# Altium schematic sheet ClockTamerMotherboard.SchDoc
size A4
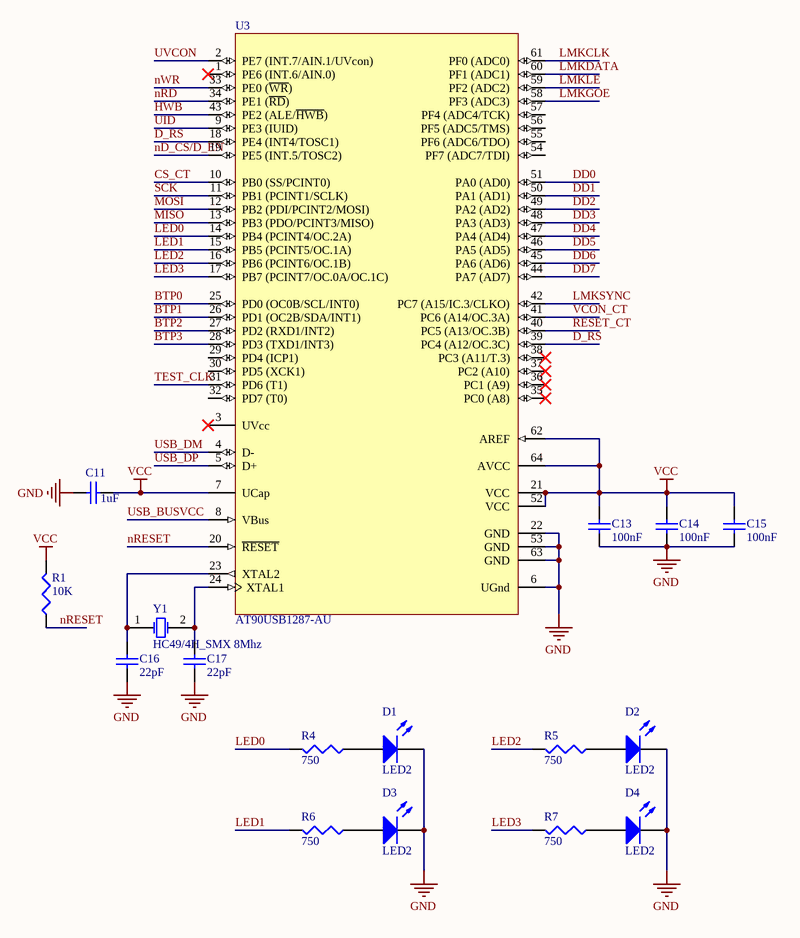
[diagram p0: ClockTamerMotherboard.SchDoc]

## Parts
C11  1uF  [1608[0603]]
C13  100nF  [1608[0603]]
C14  100nF  [1608[0603]]
C15  100nF  [1608[0603]]
C16  22pF  [1608[0603]]
C17  22pF  [1608[0603]]
D1  LED2  [3.2X1.6X1.1]
D2  LED2  [3.2X1.6X1.1]
D3  LED2  [3.2X1.6X1.1]
D4  LED2  [3.2X1.6X1.1]
R1  10K  [J1-0603]
R4  750  [J1-0603]
R5  750  [J1-0603]
R6  750  [J1-0603]
R7  750  [J1-0603]
U3  AT90USB1287-AU  [64MD_N]
Y1  HC49/4H_SMX 8Mhz  [HC49/4H_SMX]

## Nets
GND: C11.1 C13.2 C14.1 C15.1 C16.1 C17.1 D1.2(K) D2.2(K) D3.2(K) D4.2(K) U3.6(UGnd) U3.22(GND) U3.53(GND) U3.63(GND)
VCC: C11.2 C13.1 C14.2 C15.2 R1.2 U3.7(UCap) U3.21(VCC) U3.52(VCC) U3.62(AREF) U3.64(AVCC)
BTP0: U3.25(PD0_(OC0B/SCL/INT0))
BTP1: U3.26(PD1_(OC2B/SDA/INT1))
BTP2: U3.27(PD2_(RXD1/INT2))
BTP3: U3.28(PD3_(TXD1/INT3))
CS_CT: U3.10(PB0_(SS/PCINT0))
D_RS: U3.18(PE4_(INT4/TOSC1)) U3.39(PC4_(A12/OC.3C))
DD0: U3.51(PA0_(AD0))
DD1: U3.50(PA1_(AD1))
DD2: U3.49(PA2_(AD2))
DD3: U3.48(PA3_(AD3))
DD4: U3.47(PA4_(AD4))
DD5: U3.46(PA5_(AD5))
DD6: U3.45(PA6_(AD6))
DD7: U3.44(PA7_(AD7))
HWB: U3.43(PE2_(ALE/~{HWB}))
LED0: R4.2 U3.14(PB4_(PCINT4/OC.2A))
LED1: R6.2 U3.15(PB5_(PCINT5/OC.1A))
LED2: R5.2 U3.16(PB6_(PCINT6/OC.1B))
LED3: R7.2 U3.17(PB7_(PCINT7/OC.0A/OC.1C))
LMKCLK: U3.61(PF0_(ADC0))
LMKDATA: U3.60(PF1_(ADC1))
LMKGOE: U3.58(PF3_(ADC3))
LMKLE: U3.59(PF2_(ADC2))
LMKSYNC: U3.42(PC7_(A15/IC.3/CLKO))
MISO: U3.13(PB3_(PDO/PCINT3/MISO))
MOSI: U3.12(PB2_(PDI/PCINT2/MOSI))
nD_CS/D_EN: U3.19(PE5_(INT.5/TOSC2))
nRD: U3.34(PE1_(~{RD}))
nRESET: R1.1 U3.20(~{RESET})
nWR: U3.33(PE0_(~{WR}))
RESET_CT: U3.40(PC5_(A13/OC.3B))
SCK: U3.11(PB1_(PCINT1/SCLK))
TEST_CLK: U3.31(PD6_(T1))
UID: U3.9(PE3_(IUID))
USB_BUSVCC: U3.8(VBus)
USB_DM: U3.4(D-)
USB_DP: U3.5(D+)
UVCON: U3.2(PE7_(INT.7/AIN.1/UVcon))
VCON_CT: U3.41(PC6_(A14/OC.3A))
NetC16_2: C16.2 U3.23(XTAL2) Y1.1(OSC1)
NetC17_2: C17.2 U3.24(XTAL1) Y1.2(OSC2)
NetD1_1: D1.1(A) R4.1
NetD2_1: D2.1(A) R5.1
NetD3_1: D3.1(A) R6.1
NetD4_1: D4.1(A) R7.1

Not connected (* = marked no-connect by the designer): U3 1(PE6_(INT.6/AIN.0))* 3(UVcc)* 29(PD4_(ICP1)) 30(PD5_(XCK1)) 32(PD7_(T0)) 35(PC0_(A8))* 36(PC1_(A9))* 37(PC2_(A10))* 38(PC3_(A11/T.3))* 54(PF7_(ADC7/TDI)) 55(PF6_(ADC6/TDO)) 56(PF5_(ADC5/TMS)) 57(PF4_(ADC4/TCK))

## Library data of the parts
C11 C13-C17 = Cap Semi: Capacitor (Semiconductor SIM Model); Published: 8-Jun-2000; LatestRevisionDate: 29-May-2009; LatestRevisionNote: IPC-7351 Footprint Added.; PackageReference: C1206; Publisher: Altium Limited; PackageDescription: Chip Capacitor
  C11: Value: 1uF
  C13-C15: Value: 100nF
  C16 C17: Value: 22pF
D1-D4 = LED2: Typical RED, GREEN, YELLOW, AMBER GaAs LED; Published: 8-Jun-2000; LatestRevisionDate: 17-Jul-2002; LatestRevisionNote: Re-released for DXP Platform.; PackageVersion: Feb-2002; PackageReference: 3.2X1.6X1.1; Publisher: Altium Limited; PackageDescription: SM LED; 2 Flat Leads
R1 R4-R7 = Res3: Resistor; Published: 8-Jun-2000; LatestRevisionDate: 29-May-2009; LatestRevisionNote: IPC-7351 Footprint Added.; PackageReference: J1-0603; Publisher: Altium Limited; PackageDescription: Chip Resistor
  R1: Value: 10K
  R4-R7: Value: 750
U3 = AT90USB1287-AU: 8-bit AVR Microcontroller, 2.7-5.5V, 128KB Flash, 4KB EEPROM, 8KB SRAM, USB OTG Host, 64-pin TQFP, Industrial Grade (-40°C to 85°C); Published: 1-Apr-2010; DatasheetVersion: revK, Nov-2009; PackageVersion: revF, Jul-2007; PackageReference: 64MD; Publisher: Altium Limited; PackageDescription: 64-Pin Plastic Thin Profile Quad Flat Pack, 14 x 14 x 1.0 mm Body, 0.8 mm Pitch (TQFP); Supplier 1: Digi-Key; Supplier Part Number 1: AT90USB1287-AU-ND; Supplier 2: Farnell; Supplier Part Number 2: 1748496; Supplier 3: Mouser; Supplier Part Number 3: 556-AT90USB1287-AU; Code_JEDEC: MS-026-AEB; ComponentLink1Description: Manufacturer Link; ComponentLink1URL: http://www.atmel.com/products/avr/default.asp?; ComponentLink2Description: AT90USB1286/1287/646/647 Datasheet; ComponentLink2URL: http://www.atmel.com/dyn/resources/prod_documents/doc7593.pdf; ComponentLink3Description: AT90USB1286/1287/646/647 Summary; ComponentLink3URL: http://www.atmel.com/dyn/resources/prod_documents/7593S.pdf; ComponentLink4Description: Atmel.com Home; ComponentLink4URL: http://www.atmel.com
Y1 = HC49/4H_SMX: Surface Mount Quartz Crystal; Note: PCB layout complies with manufacturer's recommendation.; Published: 17-Jul-2002; DatasheetDocument: 18-Oct-1999; PackageDocument: 18-Oct-1999; PackageReference: HC49/4H_SMX; Publisher: Altium Limited; ComponentLink1Description: Manufacturer Link; ComponentLink1URL: http://www.cmac.com/mt/; ComponentLink2Description: Datasheet; ComponentLink2URL: http://www.cmac.com/mt/databook/crystals/smd/hc49_4h_smx.pdf